# Altium schematic sheet 000_STM.SchDoc
size A; SheetNumber: 2; SheetTotal: 5
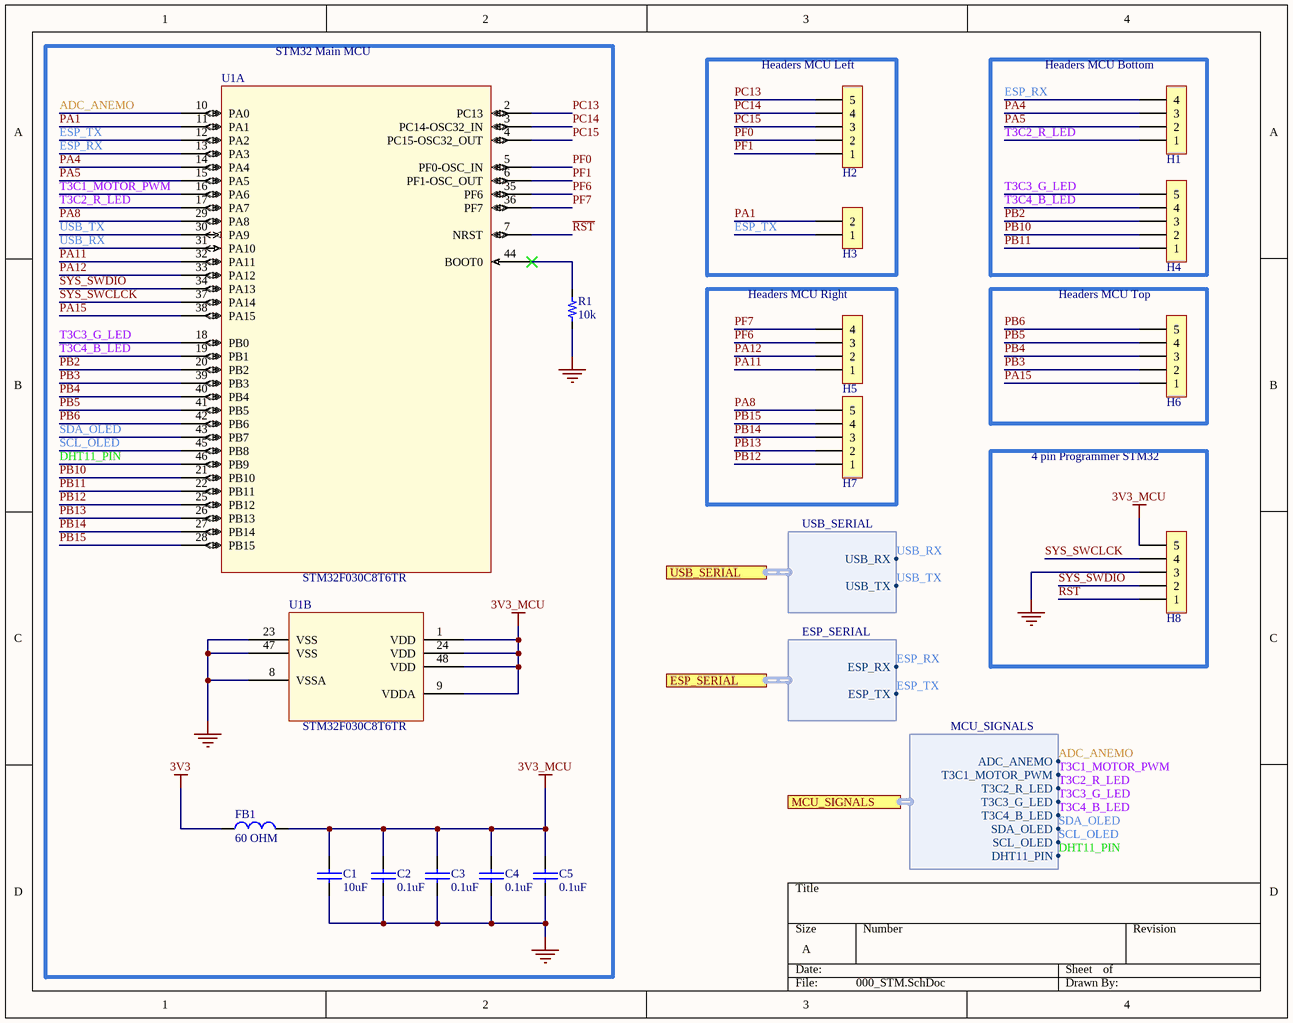
[diagram p0: 000_STM.SchDoc]

## Parts
C1  value 10uF  [0805_cap]  (hidden comment: 10uF 25V)
C2  value 0.1uF  [0603_cap]  (hidden comment: 0.1uF 50V)
C3  value 0.1uF  [0603_cap]  (hidden comment: 0.1uF 50V)
C4  value 0.1uF  [0603_cap]  (hidden comment: 0.1uF 50V)
C5  value 0.1uF  [0603_cap]  (hidden comment: 0.1uF 50V)
FB1  value 60 OHM  [0603_fb]  (hidden comment: 60OHM 2A)
H1  4x1  [H_4x1_TH_2.54mm]  (value not drawn)  (no BOM)
H2  5x1  [H_5x1_TH_100mil]  (value not drawn)  (no BOM)
H3  2x1  [H_2x1_TH_100mil]  (value not drawn)  (no BOM)
H4  5x1  [H_5x1_TH_100mil]  (value not drawn)  (no BOM)
H5  4x1  [H_4x1_TH_2.54mm]  (value not drawn)  (no BOM)
H6  5x1  [H_5x1_TH_100mil]  (value not drawn)  (no BOM)
H7  5x1  [H_5x1_TH_100mil]  (value not drawn)  (no BOM)
H8  5x1  [H_5x1_TH_100mil]  (value not drawn)  (no BOM)
R1  value 10k  [0603_res]  (hidden comment: 10k 1/10W)
U1  STM32F030C8T6TR  [LQFP48_7x7mm]  (parts A,B of 2)

## Blocks framed on the sheet
STM32 Main MCU: C1-C5 FB1 R1 U1
Headers MCU Left: H2 H3
Headers MCU Bottom: H1 H4
Headers MCU Right: H5 H7
Headers MCU Top: H6
4 pin Programmer STM32: H8

## Ports
ESP_SERIAL (harness ESP_SERIAL, see Main[2B], 100_ESP[3A]), MCU_SIGNALS (harness MCU_SIGNALS, see Main[2B], 200_Peripherals_Sensors[1D]), USB_SERIAL (harness USB_SERIAL, see Main[2B], 300_Power[3B])

## Harnesses
MCU_SIGNALS: ADC_ANEMO, T3C1_MOTOR_PWM, T3C2_R_LED, T3C3_G_LED, T3C4_B_LED, SDA_OLED, SCL_OLED, DHT11_PIN
USB_SERIAL: USB_RX, USB_TX
ESP_SERIAL: ESP_RX, ESP_TX

## Nets
3V3: FB1.1
3V3_MCU: C1.1 C2.1 C3.1 C4.1 C5.1 FB1.2 H8.5 U1.1(VDD) U1.9(VDDA) U1.24(VDD) U1.48(VDD)
GND: C1.2 C2.2 C3.2 C4.2 C5.2 H8.3 R1.1 U1.8(VSSA) U1.23(VSS) U1.47(VSS)
ADC_ANEMO: U1.10(PA0) ; port MCU_SIGNALS.ADC_ANEMO
DHT11_PIN: U1.46(PB9) ; port MCU_SIGNALS.DHT11_PIN
ESP_RX: H1.4 U1.13(PA3) ; port ESP_SERIAL.ESP_RX
ESP_TX: H3.1 U1.12(PA2) ; port ESP_SERIAL.ESP_TX
PA1: H3.2 U1.11(PA1)
PA4: H1.3 U1.14(PA4)
PA5: H1.2 U1.15(PA5)
PA8: H7.5 U1.29(PA8)
PA11: H5.1 U1.32(PA11)
PA12: H5.2 U1.33(PA12)
PA15: H6.1 U1.38(PA15)
PB2: H4.3 U1.20(PB2)
PB3: H6.2 U1.39(PB3)
PB4: H6.3 U1.40(PB4)
PB5: H6.4 U1.41(PB5)
PB6: H6.5 U1.42(PB6)
PB10: H4.2 U1.21(PB10)
PB11: H4.1 U1.22(PB11)
PB12: H7.1 U1.25(PB12)
PB13: H7.2 U1.26(PB13)
PB14: H7.3 U1.27(PB14)
PB15: H7.4 U1.28(PB15)
PC13: H2.5 U1.2(PC13)
PC14: H2.4 U1.3(PC14-OSC32_IN)
PC15: H2.3 U1.4(PC15-OSC32_OUT)
PF0: H2.2 U1.5(PF0-OSC_IN)
PF1: H2.1 U1.6(PF1-OSC_OUT)
PF6: H5.3 U1.35(PF6)
PF7: H5.4 U1.36(PF7)
~{RST}: H8.1 U1.7(NRST)
SCL_OLED: U1.45(PB8) ; port MCU_SIGNALS.SCL_OLED
SDA_OLED: U1.43(PB7) ; port MCU_SIGNALS.SDA_OLED
SYS_SWCLCK: H8.4 U1.37(PA14)
SYS_SWDIO: H8.2 U1.34(PA13)
T3C1_MOTOR_PWM: U1.16(PA6) ; port MCU_SIGNALS.T3C1_MOTOR_PWM
T3C2_R_LED: H1.1 U1.17(PA7) ; port MCU_SIGNALS.T3C2_R_LED
T3C3_G_LED: H4.5 U1.18(PB0) ; port MCU_SIGNALS.T3C3_G_LED
T3C4_B_LED: H4.4 U1.19(PB1) ; port MCU_SIGNALS.T3C4_B_LED
USB_RX: U1.31(PA10) ; port USB_SERIAL.USB_RX
USB_TX: U1.30(PA9) ; port USB_SERIAL.USB_TX
NetR1_2: R1.2 U1.44(BOOT0)

## Library data of the parts
C1 = Cap_10uF_0805_25V_: 25V 10uF X5R ±10% 0805 Multilayer Ceramic Capacitors MLCC - SMD/SMT ROHS; Manufacturer: Samsung Electro-Mechanics; Manufacturer Part Number: CL21A106KAYNNNE; Supplier 1: LCSC; Supplier Part Number 1: C15850; ComponentLink1Description: LCSC; ComponentLink1URL: https://lcsc.com/product-detail/Multilayer-Ceramic-Capacitors-MLCC-SMD-SMT_Samsung-Electro-Mechanics-CL21A106KAYNNNE_C15850.html
C2-C5 = Cap_0.1uF_0603_50V: 50V 100nF Y5V -20%~+80% 0603 Multilayer Ceramic Capacitors MLCC - SMD/SMT ROHS; Manufacturer: Walsin Tech Corp; Manufacturer Part Number: 0603F104Z500CT; Supplier 1: LCSC; Supplier Part Number 1: C83060; ComponentLink1Description: LCSC; ComponentLink1URL: https://www.lcsc.com/product-detail/Multilayer-Ceramic-Capacitors-MLCC-SMD-SMT_Walsin-Tech-Corp-0603F104Z500CT_C83060.html
FB1 = FB_60_0603_2A: 2A 1 100mΩ 60Ω@100MHz ±25% 0603 Ferrite Beads ROHS; Manufacturer: TAI-TECH; Manufacturer Part Number: HCB1608KF-600T20; ComponentLink1Description: LCSC; ComponentLink1URL: https://www.lcsc.com/product-detail/Ferrite-Beads_TAI-TECH-HCB1608KF-600T20_C369516.html; Supplier 1: LCSC; Supplier Part Number 1: C369516
H1 H5 = H_Male_4x1_TH_100mil: ComponentLink1Description: LCSC
H2 H4 H6-H8 = H_Male_5x1_TH_100mil: ComponentLink1Description: LCSC
H3 = H_Male_2x1_TH_100mil: ComponentLink1Description: LCSC
R1 = Res_10k_0603_1/10W: RES SMD 10k OHM 5% 1/10W 0603; Manufacturer: FOJAN; Manufacturer Part Number: FRC0603J103TS; ComponentLink1URL: https://www.lcsc.com/product-detail/Chip-Resistor-Surface-Mount_FOJAN-FRC0603J103TS_C2930027.html; Supplier 1: LCSC; Supplier Part Number 1: C2930027; ComponentLink1Description: LCSC
U1 = IC_STM32F030C8T6TR_LQFP48_7x7MM: IC MCU 32BIT 64KB FLASH 48LQFP; Manufacturer: STMicroelectronics; Manufacturer part number: STM32F030C8T6TR; Supplier 1: LCSC; Supplier Part Number 1: C23922; ComponentLink1Description: LCSC; ComponentLink1URL: https://www.lcsc.com/product-detail/ST-Microelectronics_STMicroelectronics-STM32F030C8T6_C23922.html